# Altium project mag_pos_01.PrjPcb
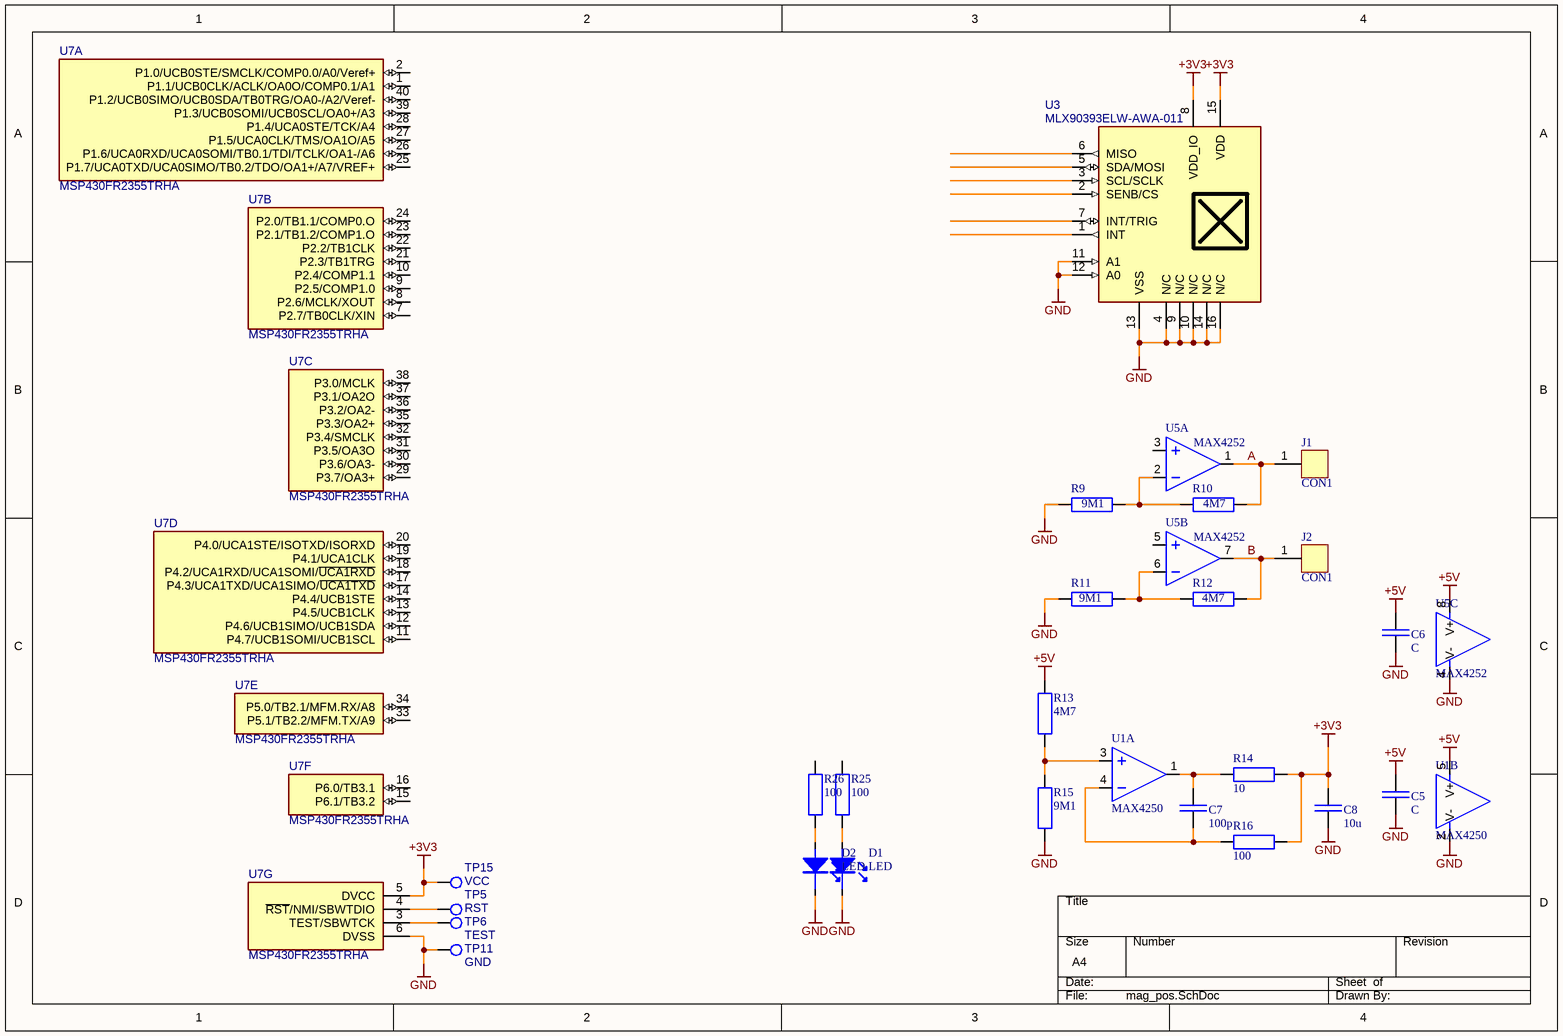
[diagram p0: mag_pos.SchDoc]
1 sheet, 26 parts. Net scope: global (net labels, ports and power ports of the same name join across sheets).
Board files: mag_pos.PcbDoc, mag_pos_nutz.PcbDoc, mag_pos_breakout.PcbDoc

## Sheet mag_pos.SchDoc
size A4

### Parts
C5  C  [C_0603_S]
C6  C  [C_0603_S]
C7  100p  [C_0603_S]
C8  10u  [C_0805_S]
D1  LED  [LED_0603_S_BLUE]
D2  LED  [LED_0603_S_GREEN]
J1  CON1  [CON_1x1_tht_BMS]
J2  CON1  [CON_1x1_tht_BMS]
R9  9M1  [R_0603_S]
R10  4M7  [R_0603_S]
R11  9M1  [R_0603_S]
R12  4M7  [R_0603_S]
R13  4M7  [R_0603_S]
R14  10  [R_0603_S]
R15  9M1  [R_0603_S]
R16  100  [R_0603_S]
R25  100  [R_0603_S]
R26  100  [R_0603_S]
TP5  RST  [TP_SMD_1MM]
TP6  TEST  [TP_SMD_1MM]
TP11  GND  [TP_SMD_1MM]
TP15  VCC  [TP_SMD_1MM]
U1  MAX4250  [SOT23-5]  (parts A,B of 2)
U3  MLX90393ELW-AWA-011  [QFN50P300X300X100-16]
U5  MAX4252  [DGK-8]  (parts A,B,C of 3)
U7  MSP430FR2355TRHA  [QFN50P600X600X100-40]  (parts A,B,C,D,E,F,G of 7)

### Nets
+3V3: C8.1 R14.2 R16.2 TP15.1 U3.8(VDD_IO) U3.15(VDD) U7.5(DVCC)
+5V: C5.1 C6.1 R13.1 U1.5(V+) U5.8(V+)
GND: C5.2 C6.2 C8.2 D1.K D2.K R9.2 R11.2 R15.2 TP11.1 U1.2(V-) U3.4(N/C) U3.9(N/C) U3.10(N/C) U3.11(A1) U3.12(A0) U3.13(VSS) U3.14(N/C) U3.16(N/C) U5.4(V-) U7.6(DVSS)
A: J1.1 R10.1 U5.1(Out_D)
B: J2.1 R12.1 U5.7(Out_D)
NetC7_1: C7.1 R14.1 U1.1(Out_D)
NetC7_2: C7.2 R16.1 U1.4(-In_D)
NetD1_A: D1.A R25.1
NetD2_A: D2.A R26.1
NetR9_1: R9.1 R10.2 U5.2(-In_D)
NetR11_1: R11.1 R12.2 U5.6(-In_D)
NetR13_2: R13.2 R15.1 U1.3(+In_D)
NetTP5_1: TP5.1 U7.4(~{RST}/NMI/SBWTDIO)
NetTP6_1: TP6.1 U7.3(TEST/SBWTCK)

Not connected (* = marked no-connect by the designer): R25 2; R26 2; U3 1(INT) 2(SENB/CS) 3(SCL/SCLK) 5(SDA/MOSI) 6(MISO) 7(INT/TRIG); U5 3(+In_D) 5(+In_D); U7 1(P1.1/UCB0CLK/ACLK/OA0O/COMP0.1/A1) 2(P1.0/UCB0STE/SMCLK/COMP0.0/A0/Veref+) 7(P2.7/TB0CLK/XIN) 8(P2.6/MCLK/XOUT) 9(P2.5/COMP1.0) 10(P2.4/COMP1.1) 11(P4.7/UCB1SOMI/UCB1SCL) 12(P4.6/UCB1SIMO/UCB1SDA) 13(P4.5/UCB1CLK) 14(P4.4/UCB1STE) 15(P6.1/TB3.2) 16(P6.0/TB3.1) 17(P4.3/UCA1TXD/UCA1SIMO/~{UCA1TXD}) 18(P4.2/UCA1RXD/UCA1SOMI/~{UCA1RXD}) 19(P4.1/UCA1CLK) 20(P4.0/UCA1STE/ISOTXD/ISORXD) 21(P2.3/TB1TRG) 22(P2.2/TB1CLK) 23(P2.1/TB1.2/COMP1.O) 24(P2.0/TB1.1/COMP0.O) 25(P1.7/UCA0TXD/UCA0SIMO/TB0.2/TDO/OA1+/A7/VREF+) 26(P1.6/UCA0RXD/UCA0SOMI/TB0.1/TDI/TCLK/OA1-/A6) 27(P1.5/UCA0CLK/TMS/OA1O/A5) 28(P1.4/UCA0STE/TCK/A4) 29(P3.7/OA3+) 30(P3.6/OA3-) 31(P3.5/OA3O) 32(P3.4/SMCLK) 33(P5.1/TB2.2/MFM.TX/A9) 34(P5.0/TB2.1/MFM.RX/A8) 35(P3.3/OA2+) 36(P3.2/OA2-) 37(P3.1/OA2O) 38(P3.0/MCLK) 39(P1.3/UCB0SOMI/UCB0SCL/OA0+/A3) 40(P1.2/UCB0SIMO/UCB0SDA/TB0TRG/OA0-/A2/Veref-)

### Library data of the parts
C7 C8 = C
R9-R16 R25 R26 = R: Normaler Widerstand
TP5 TP6 TP11 TP15 = TP_SMD_1mm: Testpoint SMD 1mm
U3 = MLX90393ELW-AWA-011: Triaxis Magnetic Node, QFN16
U7 = MSP430FR2355TRHA: Mixed-Signal Microcontroller, 16Bit, 32kB FRAM, 4kB SRAM, QFN40